# Altium schematic sheet MicroController.SchDoc: MicroController
size A4; ApprovedBy: Ekrem Turan Fırat; CheckedBy: Ekrem Turan Fırat; Author: Ekrem Turan Fırat; CompanyName: Mergen Elektronik; DrawnBy: Ekrem T. Fırat; Engineer: Ekrem Turan Fırat; Organization: Mergen Elektronik; Address1: Türkiye; DocumentNumber: 20240101; Revision: v0.0.1; SheetNumber: 4; SheetTotal: 7
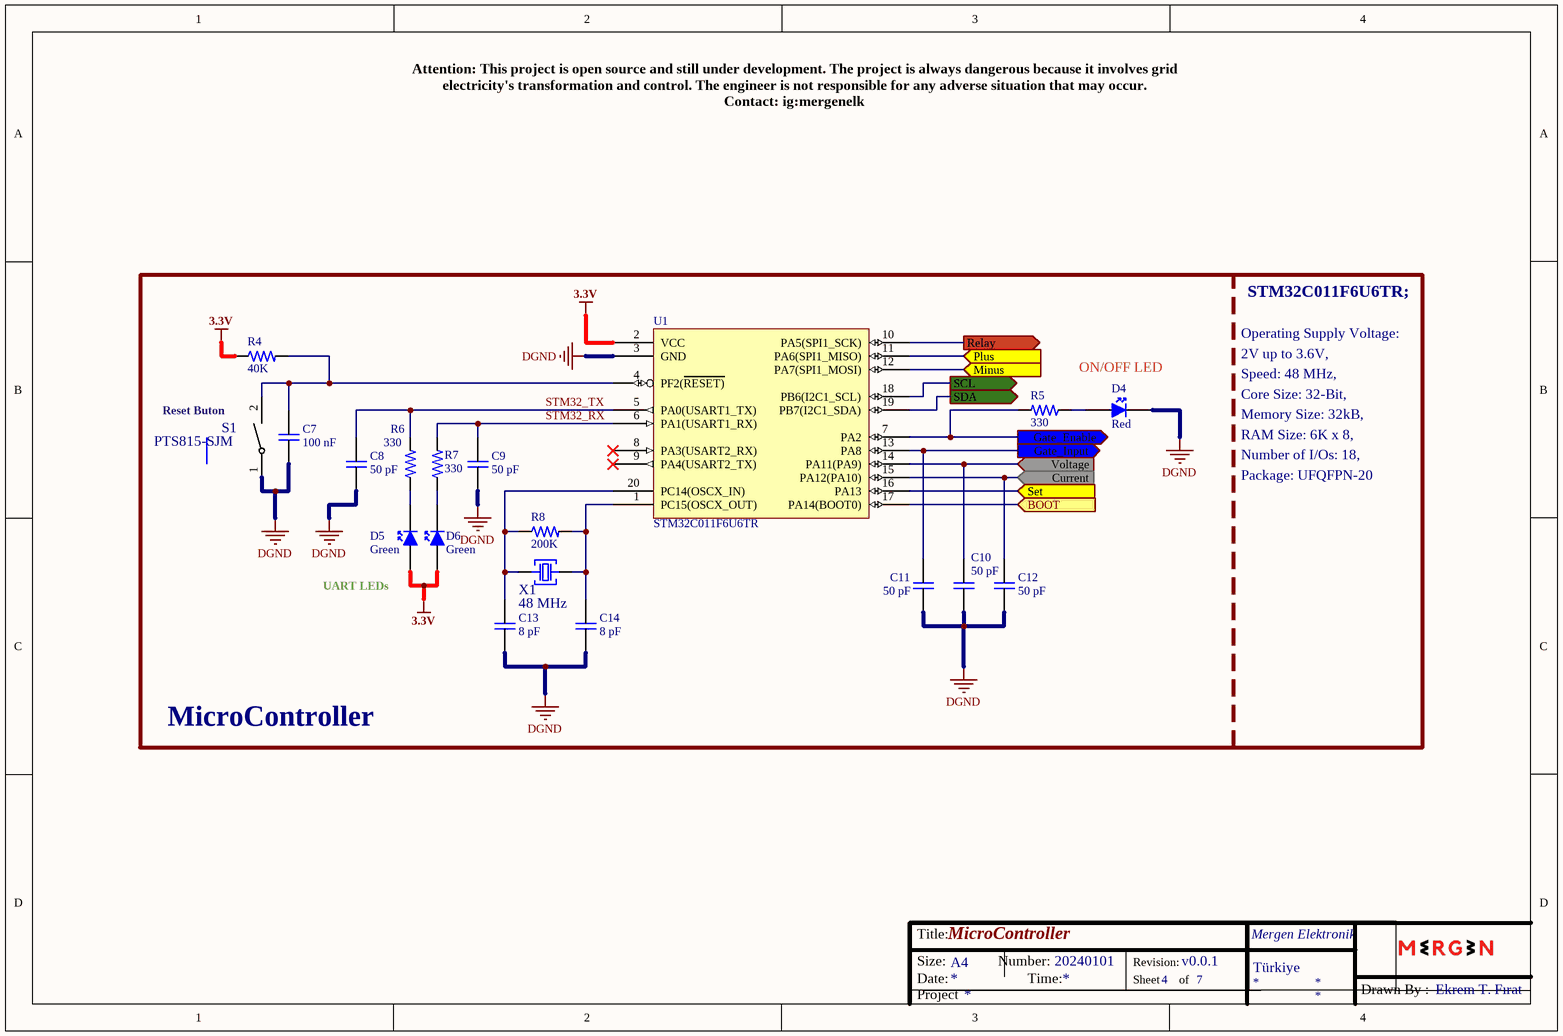
[diagram p0: MicroController.SchDoc]

## Parts
C7  100 nF  [MergenElektronik_Capacitors_Ceramics_SMDs_0603_S_NS]
C8  50 pF  [MergenElektronik_Capacitors_Ceramics_SMDs_0402_S_NS]
C9  50 pF  [MergenElektronik_Capacitors_Ceramics_SMDs_0402_S_NS]
C10  50 pF  [MergenElektronik_Capacitors_Ceramics_SMDs_0402_S_NS]
C11  50 pF  [MergenElektronik_Capacitors_Ceramics_SMDs_0402_S_NS]
C12  50 pF  [MergenElektronik_Capacitors_Ceramics_SMDs_0402_S_NS]
C13  8 pF  [MergenElektronik_Capacitors_Ceramics_SMDs_0603_S_NS]
C14  8 pF  [MergenElektronik_Capacitors_Ceramics_SMDs_0603_S_NS]
D4  Red  [MergenElektronik_Leds_SMDs_0603_S]
D5  Green  [MergenElektronik_Leds_SMDs_0603_S]
D6  Green  [MergenElektronik_Leds_SMDs_0603_S]
R4  40K  [MergenElektronik_Resistors_ChipResistors_0603_S_NS]
R5  330  [MergenElektronik_Resistors_ChipResistors_0603_S_NS]
R6  330  [MergenElektronik_Resistors_ChipResistors_0603_S_NS]
R7  330  [MergenElektronik_Resistors_ChipResistors_0603_S_NS]
R8  200K  [MergenElektronik_Resistors_ChipResistors_0603_S_NS]
S1  PTS815-SJM  [MergenElektronik_Switches_TactileSwitches_PTS815]
U1  STM32C011F6U6TR  [MergenElektronik_Microcontrollers_STMicroelectronics_UFQFPN-20]
X1  48 MHz  [MergenElektronik_Oscillators_Crystals_2-SMD]

## Ports
BOOT (in), Current (in, see Measuring[4B]), Gate_Enable (out, see GateDriverandMosfets[1B]), Gate_Input (out, see GateDriverandMosfets[1C]), Minus (in, see Control[2C]), Plus (in, see Control[2C]), Relay (out, see Measuring[1C]), SCL (out, see Control[2B]), SDA (out, see Control[2B]), Set (in, see Control[3C]), Voltage (in, see Measuring[2C])

## Nets
3.3V: D5.1(ANOT) D6.1(ANOT) R4.1 U1.2(VCC)
DGND: C7.2 C8.2 C9.2 C10.2 C11.2 C12.2 C13.2 C14.2 D4.2(KATOT) S1.1 U1.3(GND)
BOOT: U1.17(PA14(BOOT0)) ; port BOOT
Current: C12.1 U1.15(PA12(PA10)) ; port Current
Gate_Enable: R5.2 U1.7(PA2) ; port Gate_Enable
Gate_Input: C11.1 U1.13(PA8) ; port Gate_Input
Minus: U1.12(PA7(SPI1_MOSI)) ; port Minus
Plus: U1.11(PA6(SPI1_MISO)) ; port Plus
Relay: U1.10(PA5(SPI1_SCK)) ; port Relay
SCL: U1.18(PB6(I2C1_SCL)) ; port SCL
SDA: U1.19(PB7(I2C1_SDA)) ; port SDA
Set: U1.16(PA13) ; port Set
STM32_RX: C9.1 R7.2 U1.6(PA1(USART1_RX))
STM32_TX: C8.1 R6.2 U1.5(PA0(USART1_TX))
Voltage: C10.1 U1.14(PA11(PA9)) ; port Voltage
NetC7_1: C7.1 R4.2 S1.2 U1.4(PF2(RESET))
NetC13_1: C13.1 R8.1 U1.20(PC14(OSCX_IN)) X1.1
NetC14_1: C14.1 R8.2 U1.1(PC15(OSCX_OUT)) X1.2
NetD4_1: D4.1(ANOT) R5.1
NetD5_2: D5.2(KATOT) R6.1
NetD6_2: D6.2(KATOT) R7.1

Not connected (* = marked no-connect by the designer): U1 8(PA3(USART2_RX))* 9(PA4(USART2_TX))*

## Notes on the sheet
- Attention: This project is open source and still under development. The project is always dangerous because it involves grid electricity's transformation and control. The engineer is not responsible for any adverse situation that may occur.
  Contact: ig:mergenelk
- STM32C011F6U6TR;
- ON/OFF LED
- Operating Supply Voltage:
- 2V up to 3.6V,
- Speed: 48 MHz,
- Reset Buton
- Core Size: 32-Bit,
- Memory Size: 32kB,
- RAM Size: 6K x 8,
- Number of I/Os: 18,
- Package: UFQFPN-20
- UART LEDs
- MicroController
- Title:
- Size:
- Date:
- A4
- Number:
- Time:
- Revision:
- Sheet
- of
- Project
- Drawn By :

## Library data of the parts
C7 = MergenElektronik_Capacitors_Ceramic_SMDs_100nF_16V: Mergen Elektronik - Capacitors - Ceramics - SMDs - 0603 - 100 nF - 16V; Manufacturer: Samsung Electro-Mechanics; Manufacturer Number: CL10B104KO8NNNC; Model: Ceramic Capacitors; Tolerance: ±10%; Value: 100 nF; Temperature: -55°C up to +125°C; Digi-Key Number: 1276-1005-1-ND; Package: 0603(1608); Mouser Number: 187-CL10B104KO8NNNC; Mounting Type: Surface Mount; Farnell Number: 3013413; Supplier 1: Mouser; Supplier 2: Digi-Key; Supplier Part Number 1: 187-CL10B104KO8NNNC; Supplier Part Number 2: 1276-1005-6-ND; Özdisan Number: CL10B104KO8NNNC; Voltage Rated: 16V
C8-C12 = MergenElektronik_Capacitors_Ceramic_SMDs_50pF_50V: Mergen Elektronik - Capacitors - Ceramics - SMDs - 0402 - 50 pF - 50V; Manufacturer: YAGEO; Manufacturer Number: CC0402JRNPO9BN500; Model: Ceramic Capacitors; Tolerance: ±5%; Value: 50 pF; Temperature: -55°C up to +125°C; Digi-Key Number: 13-CC0402JRNPO9BN500TR-ND; Package: 0603(1608); Mouser Number: 603-CC0402JNPO9BN500; Mounting Type: Surface Mount; Supplier 1: Digi-Key; Supplier 2: Mouser; Supplier Part Number 1: 13-CC0402JRNPO9BN500TR-ND; Supplier Part Number 2: 603-CC0402JNPO9BN500; Özdisan Number: CC0402JRNPO9BN500; Voltage Rated: 50V
C13 C14 = MergenElektronik_Capacitors_Ceramic_SMDs_8pF_50V: Mergen Elektronik - Capacitors - Ceramics - SMDs - 0603 - 8 pF - 50V; Manufacturer: YAGEO; Manufacturer Number: CC0603DRNPO9BN8R0; Model: Ceramic Capacitors; Tolerance: ±0.5pF; Value: 8 pF; Temperature: -55°C up to +125°C; Digi-Key Number: 311-1057-1-ND; Package: 0603(1608); Mouser Number: 603-CC603DRNPO9BN8R0; Mounting Type: Surface Mount; Özdisan Number: CC0603DRNPO9BN8R0; Farnell Number: 3764404RL; Supplier 1: Digikey; Supplier 2: Mouser; Supplier Part Number 1: 311-1057-6-ND; Supplier Part Number 2: 603-CC603DRNPO9BN8R0; Voltage Rated: 50V
D4 = MergenElektronik_LEDs_SMDs_Red_0603: Mergen Elektronik - Leds - SMDs - Red - 0603; Manufacturer: Würth Elektronik; Manufacturer Number: 150060RS75000; Voltage Rated: 2V; Model: SMD Leds; Value: Red; Temperature: -45°C up to +85°C; Digi-Key Number: 732-4978-1-ND; Package: 0603(1608); Farnell Number: 2322071; Mouser Number: 710-150060RS75000; Mounting Type: Surface Mount; Color: Red; Özdisan Number: 150060RS75000; Supplier 1: Digi-Key; Supplier 2: Mouser; Supplier Part Number 1: 732-4978-1-ND; Supplier Part Number 2: 710-150060RS75000
D5 D6 = MergenElektronik_LEDs_SMDs_Green_0603: Mergen Elektronik - Leds - SMDs - Green - 0603; Manufacturer: Würth Elektronik; Manufacturer Number: 150060GS75000; Voltage Rated: 3.2V; Model: SMD Leds; Value: Green; Temperature: -45°C up to +85°C; Digi-Key Number: 732-4971-1-ND; Package: 0603(1608); Farnell Number: 2322070; Mouser Number: 710-150060GS75000; Mounting Type: Surface Mount; Color: Green; Özdisan Number: 150060GS75000; Supplier 1: Digi-Key; Supplier 2: Mouser; Supplier Part Number 1: 732-4971-6-ND; Supplier Part Number 2: 710-150060GS75000
R4 = MergenElektronik_Resistors_ChipResistors_0603_40K: Mergen Elektronik - Resistors - Chip Resistors - 0603 - 40K; Manufacturer: YAGEO; Manufacturer Number: RT0603BRD0740KL; Value: Chip Resistor - 0603 - 40K; Power: 1/10W; Tolerance: ±0.1%; Package: 0603(1608); Temperature: -55°C up to +155°C - X8R; Model: Chip Resistor; Digi-Key Number: 13-RT0603BRD0740KLTR-ND; Mounting Type: Surface Mount; Mouser Number: 603-RT0603BRD0740KL; Supplier 1: Digikey; Supplier 2: Mouser; Supplier Part Number 1: 13-RT0603BRD0740KLDKR-ND; Supplier Part Number 2: 603-RT0603BRD0740KL
R5-R7 = MergenElektronik_Resistors_ChipResistors_0603_330R: Mergen Elektronik - Resistors - Chip Resistors - 0603 - 330R; Manufacturer: Stackpole Electronics Inc; Manufacturer Number: RMCF0603JT330R; Value: Chip Resistor - 0603 - 330R; Power: 1/10W; Tolerance: ±5%; Package: 0603(1608); Temperature: -55°C up to +155°C - X8R; Model: Chip Resistor; Digi-Key Number: RMCF0603JT330RCT-ND; Mounting Type: Surface Mount; Supplier 1: Digi-Key; Supplier Part Number 1: RMCF0603JT330RCT-ND
R8 = MergenElektronik_Resistors_ChipResistors_0603_200K: Mergen Elektronik - Resistors - Chip Resistors - 0603 - 200K; Manufacturer: Stackpole Electronics Inc; Manufacturer Number: RMCF0603FT200K; Value: Chip Resistor - 0603 - 200K; Power: 1/10W; Tolerance: ±1%; Package: 0603(1608); Temperature: -55°C up to +155°C - X8R; Model: Chip Resistor; Digi-Key Number: RMCF0603FT200KTR-ND; Mounting Type: Surface Mount; Mouser Number: 708-RMCF0603FT200K; Supplier 1: Digikey; Supplier 2: Mouser; Supplier Part Number 1: RMCF0603FT200KTR-ND; Supplier Part Number 2: 708-RMCF0603FT200K
S1 = MergenElektronik_Switches_TactileSwitches_PTS815-SJM: Mergen Elektronik - Switches - Tactile  Switches; Manufacturer Number: PTS815 SJM 250 SMTR LFS; Manufacturer: C&K; Current Rating: 50mA; Voltage Rated: 12VDC; Digi-Key Number: CKN12215-1-ND; Model: Tactile Switches; Mounting Type: Surface Mount; Package: PTS815; Temperature: -20°C up to +70°C; Value: PTS815-SJM; Mouser Number: 611-PTS815SJM250SMTR; Farnell Number: 3780619; Supplier 1: Mouser; Supplier 2: Digi-Key; Supplier Part Number 1: 611-PTS815SJM250SMTR; Supplier Part Number 2: CKN12215-6-ND
U1 = MergenElektronik_Microcontrollers_STMicroelectronics_STM32C011F6U6TR: Mergen Elektronik - Microcontrollers - STMicroelectronics - STM32C011F6U6TR; Model: ARM® Cortex®-M0+ Microcontroller; Operating Supply Voltage: 2V up to 3.6V; Number of I/O: 18; Speed: 48MHz; Core Size: 32-Bit; Memory Size: 32kB; Ram Size: 6K x 8; Digi-Key Number: 497-STM32C011F6U6TR-ND; Manufacturer: STMicroelectronics; Manufacturer Number: STM32C011F6U6TR; Mounting Type: Surface Mount; Mouser Number: 511-STM32C011F6U6TR; Package: UFQFPN-20; Temperature: -40°C up to 85°C (TA); Value: STM32C011F6U6TR; Farnell Number: 4138292RL; Supplier 1: Digikey; Supplier 2: Mouser; Supplier Part Number 1: 497-STM32C011F6U6TRCT-ND; Supplier Part Number 2: 511-STM32C011F6U6TR
X1 = MergenElektronik_Oscillators_Crystals_2_SMD_48MHz: Mergen Elektronik - Oscilators - Crystals - 2-SMD - 48 MHz; Manufacturer: NDK America, Inc.; Manufacturer Number: LNCD1-48M; Model: Crystal Oscilator; Value: 12 MHz; Load Capacitance: 8 pF; Digi-Key Number: 644-LNCD1-48MTR-ND; Mounting Type: Surface Mount; Frequency: 48 MHz; Package: 2-SMD; Temperature: -40°C up to 85°C; Supplier 1: Digi-Key; Supplier Part Number 1: 644-LNCD1-48MTR-ND